# Altium schematic sheet Connectors.SchDoc: =DocumentName
size A4; Organization: Queen's Formula SAE; Address1: 130 Stuart St, Kingston; Address2: Ontario; Address3: Canada; Address4: K7L 2V9; DocumentNumber: 1; Revision: 0; SheetNumber: 1; SheetTotal: 1
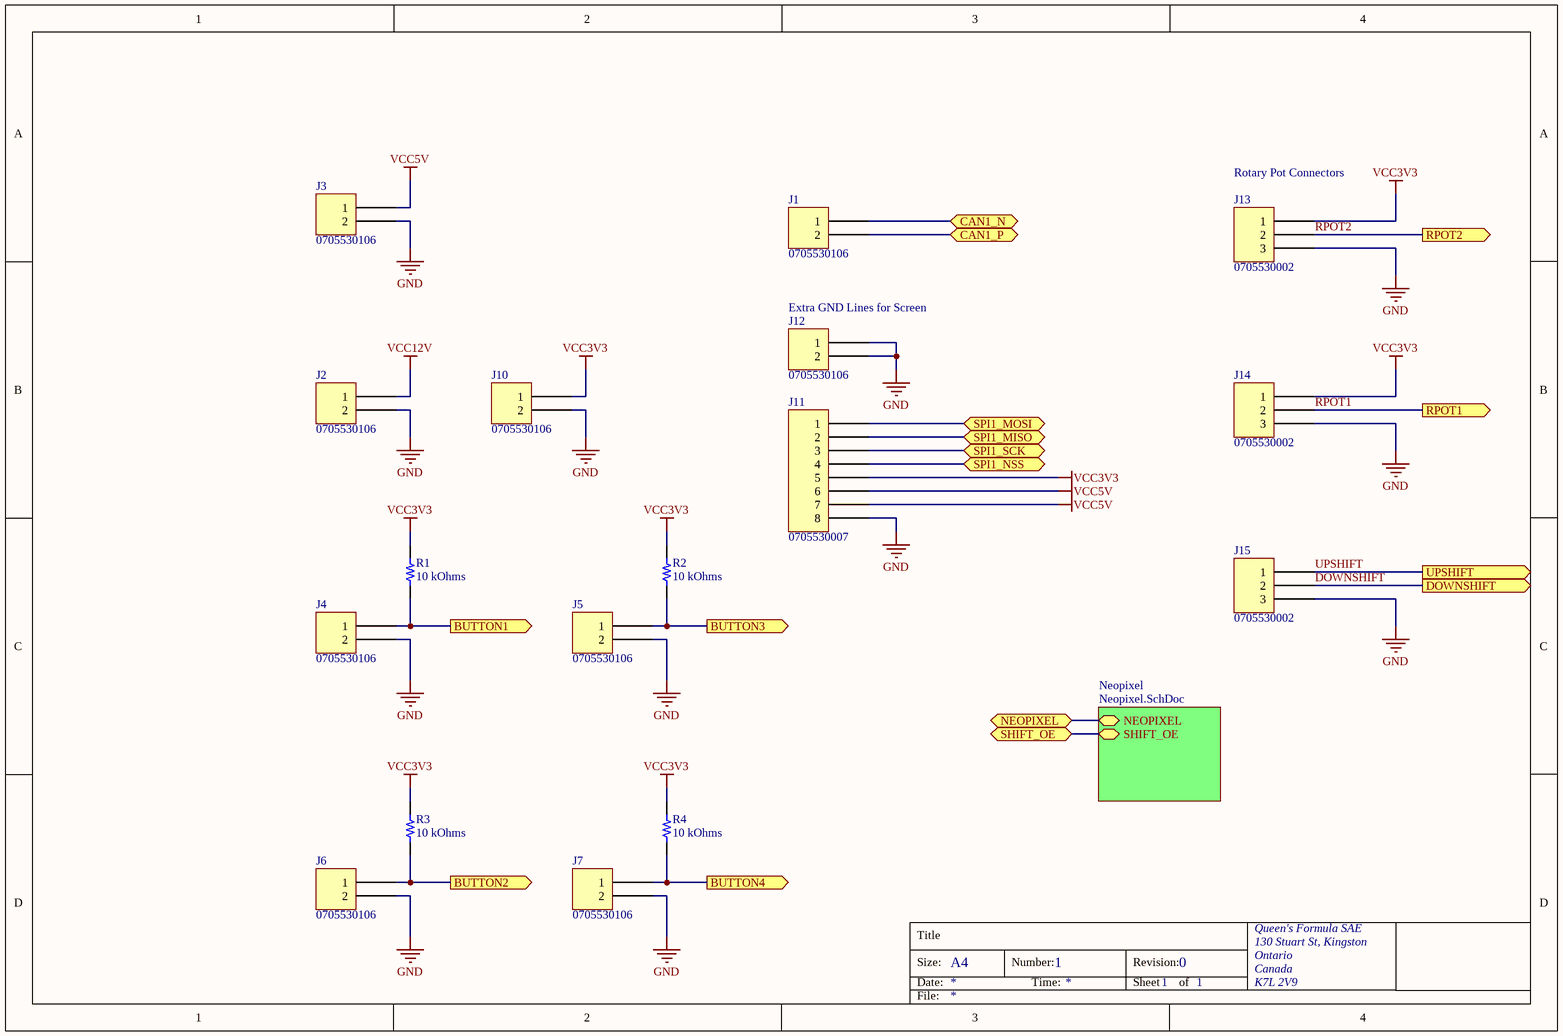
[diagram p0: Connectors.SchDoc]

## Parts
J1  0705530106  [MOLEX SDA-70553-2PIN]
J2  0705530106  [MOLEX SDA-70553-2PIN]
J3  0705530106  [MOLEX SDA-70553-2PIN]
J4  0705530106  [MOLEX SDA-70553-2PIN]
J5  0705530106  [MOLEX SDA-70553-2PIN]
J6  0705530106  [MOLEX SDA-70553-2PIN]
J7  0705530106  [MOLEX SDA-70553-2PIN]
J10  0705530106  [MOLEX SDA-70553-2PIN]
J11  0705530007  [MOLEX SDA-70553-8PIN]
J12  0705530106  [MOLEX SDA-70553-2PIN]
J13  0705530002  [MOLEX SDA-70553-3PIN]
J14  0705530002  [MOLEX SDA-70553-3PIN]
J15  0705530002  [MOLEX SDA-70553-3PIN]
R1  10 kOhms  [RES 0402_1005]
R2  10 kOhms  [RES 0402_1005]
R3  10 kOhms  [RES 0402_1005]
R4  10 kOhms  [RES 0402_1005]

## Sub-sheets
Neopixel = Neopixel.SchDoc: NEOPIXEL (bidir), SHIFT_OE (bidir)

## Ports
BUTTON1 (out), BUTTON2 (out), BUTTON3 (out), BUTTON4 (out), CAN1_N (bidir), CAN1_P (bidir), DOWNSHIFT (out), NEOPIXEL (bidir), RPOT1 (out), RPOT2 (out), SHIFT_OE (bidir), SPI1_MISO (bidir), SPI1_MOSI (bidir), SPI1_NSS (bidir), SPI1_SCK (bidir), UPSHIFT (out)

## Nets
GND: J2.2 J3.2 J4.2 J5.2 J6.2 J7.2 J10.2 J11.8 J12.1 J12.2 J13.3 J14.3 J15.3
VCC3V3: J10.1 J11.5 J13.1 J14.1 R1.2 R2.2 R3.2 R4.2
VCC5V: J3.1 J11.6 J11.7
VCC12V: J2.1
BUTTON1: J4.1 R1.1 ; port BUTTON1
BUTTON2: J6.1 R3.1 ; port BUTTON2
BUTTON3: J5.1 R2.1 ; port BUTTON3
BUTTON4: J7.1 R4.1 ; port BUTTON4
CAN1_N: J1.1 ; port CAN1_N
CAN1_P: J1.2 ; port CAN1_P
DOWNSHIFT: J15.2 ; port DOWNSHIFT
NEOPIXEL: port NEOPIXEL, sheet Neopixel/NEOPIXEL
RPOT1: J14.2 ; port RPOT1
RPOT2: J13.2 ; port RPOT2
SHIFT_OE: port SHIFT_OE, sheet Neopixel/SHIFT_OE
SPI1_MISO: J11.2 ; port SPI1_MISO
SPI1_MOSI: J11.1 ; port SPI1_MOSI
SPI1_NSS: J11.4 ; port SPI1_NSS
SPI1_SCK: J11.3 ; port SPI1_SCK
UPSHIFT: J15.1 ; port UPSHIFT

## Notes on the sheet
- (near J13) Rotary Pot Connectors
- (near J12) Extra GND Lines for Screen
- Title
- Size:
- Date:
- A4
- Number:
- Time:
- Revision:
- Sheet
- of
- File:

## Library data of the parts
J1-J7 J10 J12 = 0705530106: CONN HEADER R/A 2POS 2.54MM; Manufacturer: Molex; Contact Length - Mating: 0.240" (6.10mm); Contact Length - Post: 0.130" (3.30mm); Material Flammability Rating: UL94 V-0; Number of Positions: 2; Number of Positions Loaded: All; Pitch - Mating: 0.100" (2.54mm); Shrouding: Shrouded - 4 Wall; Style: Board to Cable/Wire; Voltage Rating: 250V; Part Number: 0705530106; ComponentLink1Description: Datasheet; ComponentLink1URL: https://www.molex.com/pdm_docs/sd/705530106_sd.pdf; ComponentLink2Description: DigiKey Link; ComponentLink2URL: http://digikey.com/product-detail/en/molex/0705530106/WM4153-ND/1643386; Connector Type: Header; Contact Finish - Mating: Gold; Contact Finish - Post: Tin; Contact Finish Thickness - Mating: 30.0µin (0.76µm); Contact Material: Phosphor Bronze; Contact Shape: Square; Contact Type: Male Pin; Fastening Type: Latch Holder; Insulation Color: Black; Insulation Height: 0.215" (5.45mm); Insulation Material: Polyester, Glass Filled; LastUpdated: 2020-01-12 11:55:40 PM; Lifecycle Status: Active; Minimum Order: 1; Mounting Type: Through Hole, Right Angle; Number of Rows: 1; Operating Temperature: -40°C ~ 105°C; Packaging: Tube; PartId: 85; Part Status: Active; Price: 1.38; Series: SL 70553; Supplier 1: DigiKey; Supplier Part Number 1: WM4153-ND; Termination: Solder
J11 = 0705530007: CONN HEADER R/A 8POS 2.54MM; Part Number: 0705530007
J13 = 0705530002: CONN HEADER R/A 3POS 2.54MM; Part Number: 0705530002
J14 J15 = 0705530002: CONN HEADER R/A 3POS 2.54MM; Manufacturer: Molex; Contact Length - Mating: 0.240" (6.10mm); Contact Length - Post: 0.130" (3.30mm); Material Flammability Rating: UL94 V-0; Number of Positions: 3; Number of Positions Loaded: All; Pitch - Mating: 0.100" (2.54mm); Shrouding: Shrouded - 4 Wall; Style: Board to Cable/Wire; Voltage Rating: 250V; Part Number: 0705530002; ComponentLink1Description: Datasheet; ComponentLink1URL: https://www.molex.com/pdm_docs/sd/705530002_sd.pdf; ComponentLink2Description: DigiKey Link; ComponentLink2URL: http://digikey.com/product-detail/en/molex/0705530002/WM4901-ND/114955; Connector Type: Header; Contact Finish - Mating: Gold; Contact Finish - Post: Tin; Contact Finish Thickness - Mating: 15.0µin (0.38µm); Contact Material: Phosphor Bronze; Contact Shape: Square; Contact Type: Male Pin; Fastening Type: Latch Holder; Insulation Color: Black; Insulation Height: 0.215" (5.45mm); Insulation Material: Polyester, Glass Filled; LastUpdated: 2020-01-12 11:55:56 PM; Lifecycle Status: Active; Minimum Order: 1; Mounting Type: Through Hole, Right Angle; Number of Rows: 1; Operating Temperature: -40°C ~ 105°C; Packaging: Tube; PartId: 86; Part Status: Active; Price: 1.02; Series: SL 70553; Supplier 1: DigiKey; Supplier Part Number 1: WM4901-ND; Termination: Solder
R1-R4 = CPF0402B10KE1: RES SMD 10K OHM 0.1% 1/16W 0402; Manufacturer: TE Connectivity Passive Product; Power (Watts): 0.063W, 1/16W; Temperature Coefficient: ±25ppm/°C; Part Number: CPF0402B10KE1; Value: 10 kOhms; ComponentLink1Description: Datasheet; ComponentLink1URL: https://www.te.com/commerce/DocumentDelivery/DDEController?Action=srchrtrv&DocNm=1773200&DocType=DS&DocLang=English; ComponentLink2Description: DigiKey Link; ComponentLink2URL: http://digikey.com/product-detail/en/te-connectivity-passive-product/CPF0402B10KE1/A102579CT-ND/2729112; Composition: Thin Film; Device Package: 0402 (1005 Metric); Height - Seated (Max): 0.014" (0.35mm); LastUpdated: 2020-09-02 1:07:41 AM; Lifecycle Status: Active; Minimum Order: 1; Number of Terminations: 2; Operating Temperature: -55°C ~ 155°C; Package / Case: 0402 (1005 Metric); Packaging: TapeAndReel; PartId: 15889; Part Status: Active; Price: 0.13; Resistance: 10 kOhms; Series: CPF, Neohm; Size / Dimension: 0.039" L x 0.020" W (1.00mm x 0.50mm); Supplier 1: DigiKey; Supplier Part Number 1: A102579CT-ND; Supplier Device Package: 0402; Tolerance: ±0.1%